# Altium project 粉墨.PrjPcb
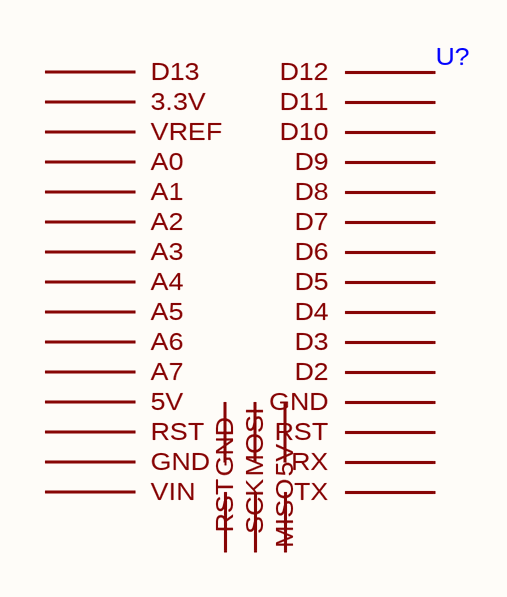
[diagram p0: Arduino Nano.schdoc]
2 sheets, 1 parts. Net scope: global (net labels, ports and power ports of the same name join across sheets).
Board files: ARDUINO NANO.pcbdoc, ARDUINO NANO_2023-07-29.pcbdoc, 粉墨.PcbDoc
Sheets:
  Arduino Nano.schdoc
  粉墨.SchDoc

## Sheet Arduino Nano.schdoc
size 64 x 63 mm; SheetNumber: 1; SheetTotal: 2

### Parts
U?  (no value)  [ARDUINO NANO]

### Nets

Not connected (* = marked no-connect by the designer): U? 1(TX) 2(RX) 3(RST) 4(GND) 5(D2) 6(D3) 7(D4) 8(D5) 9(D6) 10(D7) 11(D8) 12(D9) 13(D10) 14(D11) 15(D12) 16(D13) 17(3.3V) 18(VREF) 19(A0) 20(A1) 21(A2) 22(A3) 23(A4) 24(A5) 25(A6) 26(A7) 27(5V) 28(RST) 29(GND) 30(VIN) 31(GND) 32(MOSI) 33(5V) 34(MISO) 35(SCK) 36(RST)

### Library data of the parts
U? = Arduino Nano

## Sheet 粉墨.SchDoc
size A4; SheetNumber: 1; SheetTotal: 1